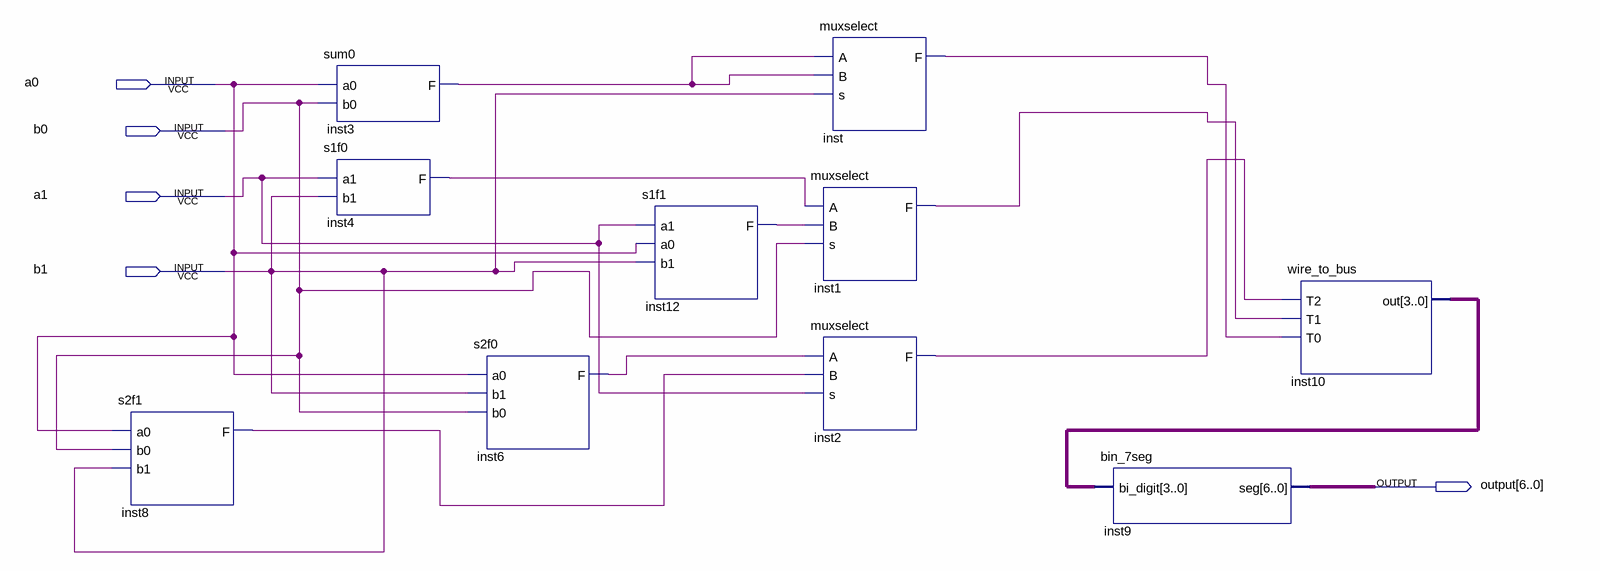
[diagram p0: schematic sheet]
// Quartus schematic lab4.bdf as structural Verilog: 10 symbols, 5 pins
module lab4 (
  input  a0,
  input  b0,
  input  a1,
  input  b1,
  output [6:0] \output 
);

  wire inst1_f, inst2_f, inst3_f, inst4_f, inst6_f, inst8_f, inst12_f, inst_f;
  wire [3:0] inst10_out;

  s2f1 inst8 (.a0(a0), .b0(b0), .b1(b1), .F(inst8_f));
  sum0 inst3 (.a0(a0), .b0(b0), .F(inst3_f));
  s1f0 inst4 (.a1(a1), .b1(b1), .F(inst4_f));
  s2f0 inst6 (.a0(a0), .b1(b1), .b0(b0), .F(inst6_f));
  s1f1 inst12 (.a1(a1), .a0(a0), .b1(b1), .F(inst12_f));
  muxselect inst (.A(inst3_f), .B(inst3_f), .s(b1), .F(inst_f));
  muxselect inst1 (.A(inst4_f), .B(inst12_f), .s(b0), .F(inst1_f));
  muxselect inst2 (.A(inst6_f), .B(inst8_f), .s(a1), .F(inst2_f));
  bin_7seg inst9 (.bi_digit(inst10_out), .seg(\output ));
  wire_to_bus inst10 (.T2(inst2_f), .T1(inst1_f), .T0(inst_f), .out(inst10_out));
endmodule
